# EAGLE design WallGrinder (EAGLE 9.1.3)
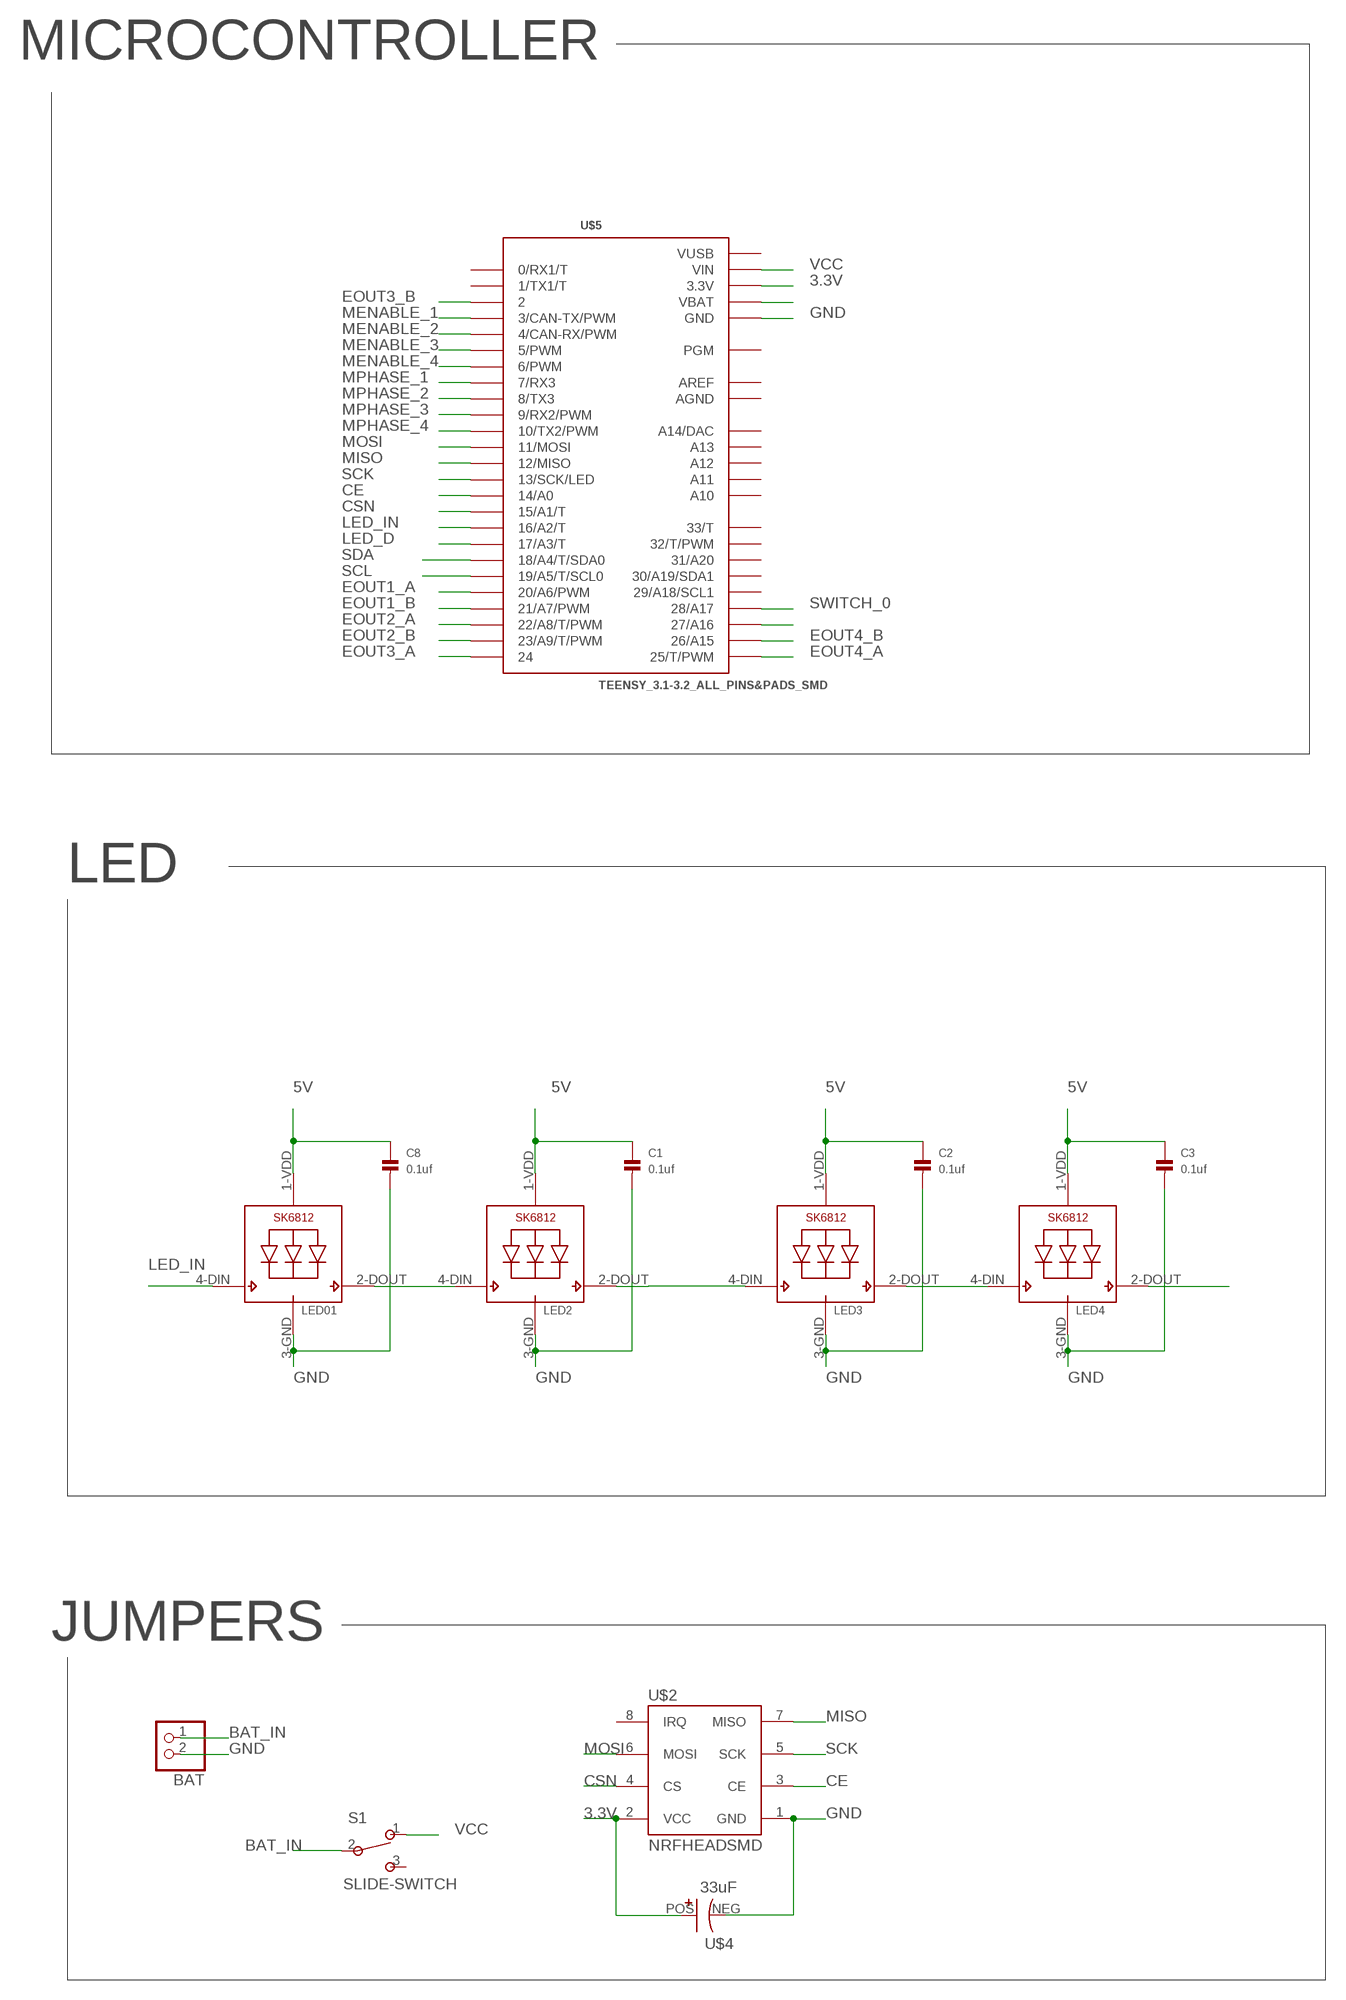
[diagram p0: schematic, sheet 1, part 1 of 2]
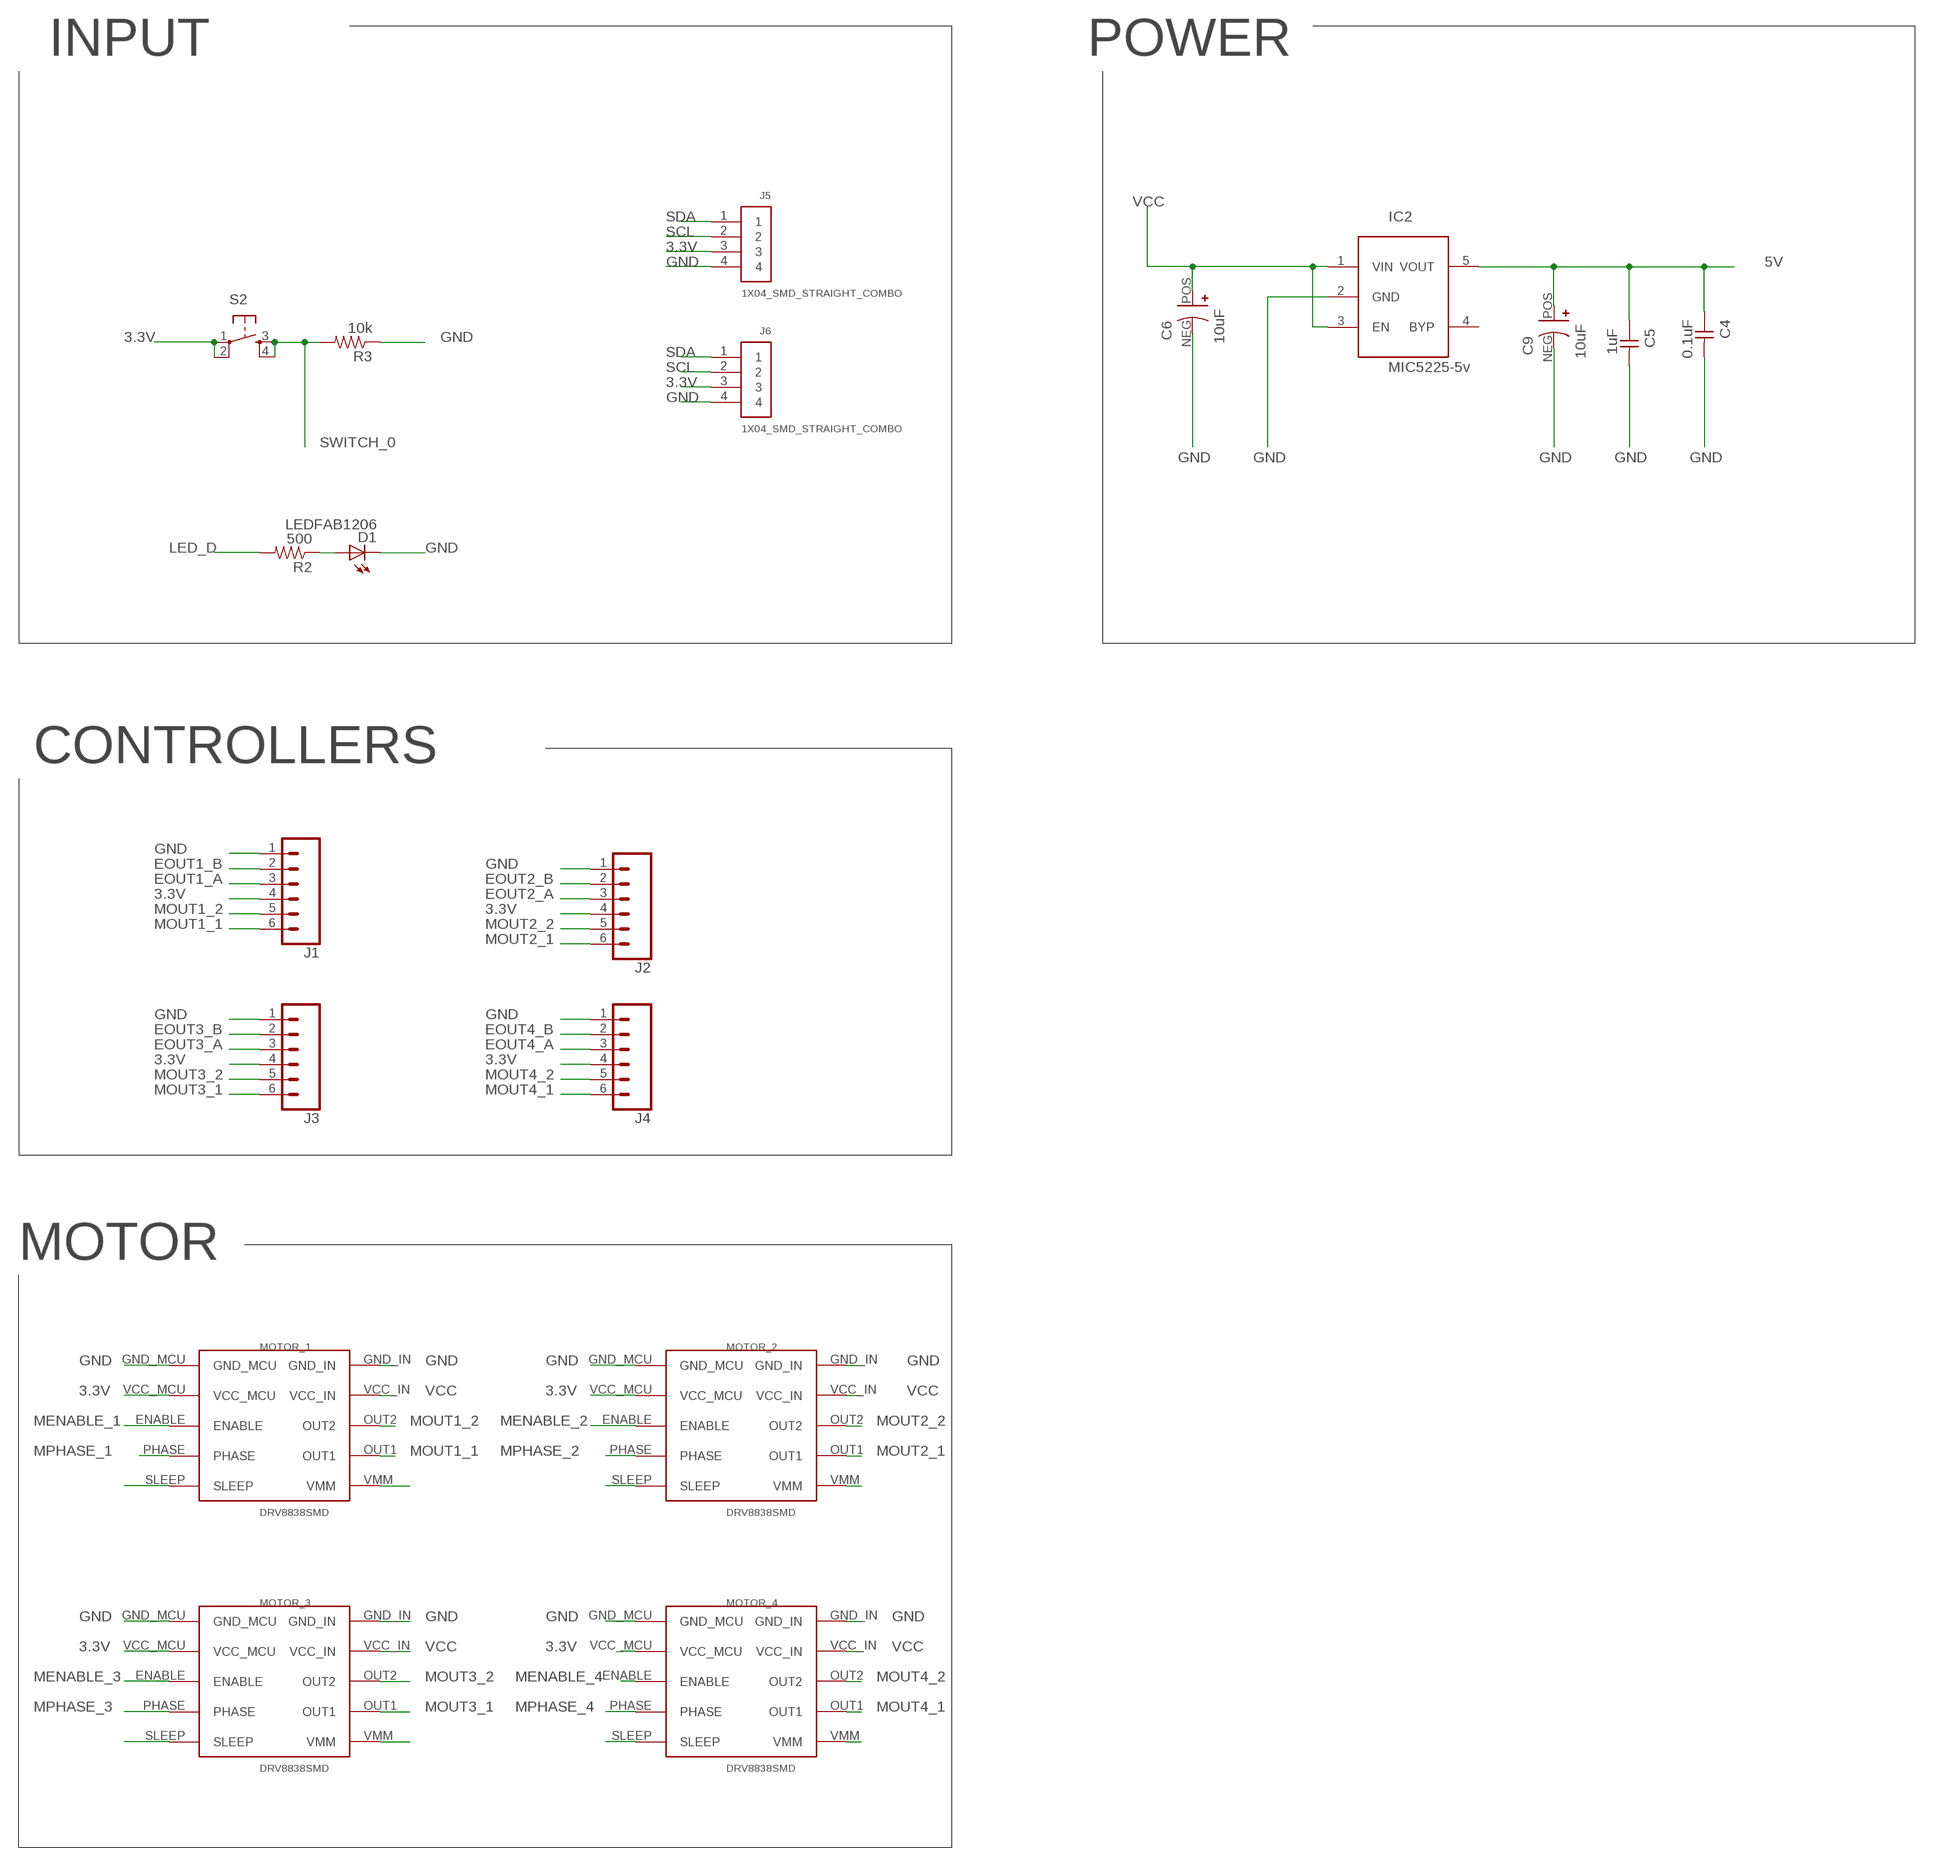
[diagram p1: schematic, sheet 1, part 2 of 2]

## Parts
BAT  JST_2PIN-SMT-RA  [JST-PH-2-SMT-RA]
C1  0.1uf  CAP_CERAMIC1206  [1206]
C2  0.1uf  CAP_CERAMIC1206  [1206]
C3  0.1uf  CAP_CERAMIC1206  [1206]
C4  0.1uF  CAP-UNPOLARIZEDFAB  [C1206FAB]
C5  1uF  CAP-UNPOLARIZEDFAB  [C1206FAB]
C6  10uF  POLCAP-PANASONIC-SMD-B01  [PANASONIC-CAP-SMD-B]
C8  0.1uf  CAP_CERAMIC1206  [1206]
C9  10uF  POLCAP-PANASONIC-SMD-B01  [PANASONIC-CAP-SMD-B]
D1  LEDFAB1206  [LED1206FAB]
IC2  MIC5225-5v  LP298XS  [SOT23-5L]
J1  CONN_06SMD_MALE  [1X06_SMD_MALE]
J2  CONN_06SMD_MALE  [1X06_SMD_MALE]
J3  CONN_06SMD_MALE  [1X06_SMD_MALE]
J4  CONN_06SMD_MALE  [1X06_SMD_MALE]
J5  1X04_SMD_STRAIGHT_COMBO  1X4SMT  [1X4-SMT]
J6  1X04_SMD_STRAIGHT_COMBO  1X4SMT  [1X4-SMT]
LED01  SK6812_5050  [LED5050]
LED2  SK6812_5050  [LED5050]
LED3  SK6812_5050  [LED5050]
LED4  SK6812_5050  [LED5050]
MOTOR_1  DRV8838SMD  [DRV8838SMD]
MOTOR_2  DRV8838SMD  [DRV8838SMD]
MOTOR_3  DRV8838SMD  [DRV8838SMD]
MOTOR_4  DRV8838SMD  [DRV8838SMD]
R2  500  RES-US1206FAB  [R1206FAB]
R3  10k  RES-US1206FAB  [R1206FAB]
S1  SLIDE-SWITCH  [AYZ0102AGRLC]
S2  6MM_SWITCH6MM_SWITCH  [6MM_SWITCH]
U$2  NRFHEADSMD  [2.54MM]
U$4  33uF  POLCAP-PANASONIC-SMD-C  [PANASONIC-CAP-SMD-C]
U$5  TEENSY_3.1-3.2_ALL_PINS&PADS_SMD  [TEENSY_3.0-3.2_ALL_PINS_&_PADS_SMD]

## Nets
3.3V: J1.4 J2.4 J3.4 J4.4 J5.3 J6.3 MOTOR_1.VCC_MCU MOTOR_2.VCC_MCU MOTOR_3.VCC_MCU MOTOR_4.VCC_MCU S2.1(P) S2.2(P1) U$2.2(VCC) U$4.POS(+) U$5.3.3V U$5.3.3V1(3.3V) U$5.3.3V2(3.3V)
5V: C1.1 C2.1 C3.1 C4.1 C5.1 C8.1 C9.POS(+) IC2.5(VOUT) LED01.1-VDD(VDD) LED2.1-VDD(VDD) LED3.1-VDD(VDD) LED4.1-VDD(VDD)
BAT_IN: BAT.1 S1.2
CE: U$2.3(CE) U$5.14/A0
CSN: U$2.4(CS) U$5.15/A1(15/A1/T)
EOUT1_A: J1.3 U$5.20/A6(20/A6/PWM)
EOUT1_B: J1.2 U$5.21/A7(21/A7/PWM)
EOUT2_A: J2.3 U$5.22/A8(22/A8/T/PWM)
EOUT2_B: J2.2 U$5.23/A9(23/A9/T/PWM)
EOUT3_A: J3.3 U$5.24
EOUT3_B: J3.2 U$5.2
EOUT4_A: J4.3 U$5.25(25/T/PWM)
EOUT4_B: J4.2 U$5.26(26/A15)
GND: BAT.2 C1.2 C2.2 C3.2 C4.2 C5.2 C6.NEG(-) C8.2 C9.NEG(-) D1.2(C) IC2.2(GND) J1.1 J2.1 J3.1 J4.1 J5.4 J6.4 LED01.3-GND(GND) LED2.3-GND(GND) LED3.3-GND(GND) LED4.3-GND(GND) MOTOR_1.GND_IN MOTOR_1.GND_MCU MOTOR_2.GND_IN MOTOR_2.GND_MCU MOTOR_3.GND_IN MOTOR_3.GND_MCU MOTOR_4.GND_IN MOTOR_4.GND_MCU R3.1 U$2.1(GND) U$4.NEG(-) U$5.GND U$5.GND1(GND) U$5.GND2(GND)
LED_D: R2.2 U$5.17/A3(17/A3/T)
LED_IN: LED01.4-DIN(DI) U$5.16/A2(16/A2/T)
LED_IN1: LED2.2-DOUT(DO) LED3.4-DIN(DI)
LED_IN2: LED3.2-DOUT(DO) LED4.4-DIN(DI)
MENABLE_1: MOTOR_1.ENABLE U$5.3(3/CAN-TX/PWM)
MENABLE_2: MOTOR_2.ENABLE U$5.4(4/CAN-RX/PWM)
MENABLE_3: MOTOR_3.ENABLE U$5.5(5/PWM)
MENABLE_4: MOTOR_4.ENABLE U$5.6(6/PWM)
MISO: U$2.7(MISO) U$5.12(12/MISO)
MOSI: U$2.6(MOSI) U$5.11(11/MOSI)
MOUT1_1: J1.6 MOTOR_1.OUT1
MOUT1_2: J1.5 MOTOR_1.OUT2
MOUT2_1: J2.6 MOTOR_2.OUT1
MOUT2_2: J2.5 MOTOR_2.OUT2
MOUT3_1: J3.6 MOTOR_3.OUT1
MOUT3_2: J3.5 MOTOR_3.OUT2
MOUT4_1: J4.6 MOTOR_4.OUT1
MOUT4_2: J4.5 MOTOR_4.OUT2
MPHASE_1: MOTOR_1.PHASE U$5.7(7/RX3)
MPHASE_2: MOTOR_2.PHASE U$5.8(8/TX3)
MPHASE_3: MOTOR_3.PHASE U$5.9(9/RX2/PWM)
MPHASE_4: MOTOR_4.PHASE U$5.10(10/TX2/PWM)
N$1: D1.1(A) R2.1
N$2: MOTOR_1.VMM
N$3: LED01.2-DOUT(DO) LED2.4-DIN(DI)
N$5: U$5.VBAT
N$7: U$5.27(27/A16)
N$8: LED4.2-DOUT(DO)
N$15: MOTOR_1.SLEEP
N$20: MOTOR_3.SLEEP
N$25: MOTOR_3.VMM
N$30: MOTOR_4.VMM
N$35: MOTOR_4.SLEEP
N$36: MOTOR_2.VMM
N$45: MOTOR_2.SLEEP
SCK: U$2.5(SCK) U$5.13(13/SCK/LED)
SCL: J5.2 J6.2 U$5.19/A5(19/A5/T/SCL0)
SDA: J5.1 J6.1 U$5.18/A4(18/A4/T/SDA0)
SWITCH_0: R3.2 S2.3(S) S2.4(S1) U$5.28(28/A17)
VCC: C6.POS(+) IC2.1(VIN) IC2.3(EN) MOTOR_1.VCC_IN MOTOR_2.VCC_IN MOTOR_3.VCC_IN MOTOR_4.VCC_IN S1.1 U$5.VIN
Unconnected: IC2.4(BYP) S1.3 U$2.8(IRQ) U$5.0(0/RX1/T) U$5.1(1/TX1/T) U$5.29(29/A18/SCL1) U$5.30(30/A19/SDA1) U$5.31(31/A20) U$5.32(32/T/PWM) U$5.33(33/T) U$5.A10 U$5.A11 U$5.A12 U$5.A13 U$5.PGM U$5.RESET/DAC(A14/DAC)

## Notes on the sheet
- MICROCONTROLLER | INPUT | POWER
- CONTROLLERS
- LED
- MOTOR
- JUMPERS

## Power pins joined to a net without a drawn wire
AGND: U$5.AGND
AREF: U$5.AREF
VUSB: U$5.VUSB

## Library data of the parts
BAT = adafruit:JST_2PIN: JST 2-Pin Connectors of various flavors SMT-RA (S2B-PH-SM4) 4UConnector #17311 SMT (B2B-PH-SM4) THM-RA (S2B-PH) THM (B2B-PH)
C1-C3 C8 = microbuilder:CAP_CERAMIC: Ceramic Capacitors 0402 - 0402 Surface Mount Capacitors 16pF 50V 5% [Digikey: 445-4899-2-ND] 18pF 50V 5% [Digikey: 490-1281-2-ND] 22pF 50V 5% [Digikey: 490-1283-2-ND] 68pF 50V 5% [Digikey: 490-1289-2-ND] 0.1uF 10V 10% [Digikey: 490-1318-2-ND] 1.0uF 6.3V 10% [Digikey: 490-1320-2-ND] 0603 - 0603 Surface Mount Capacitors 16 pF 50V 5% [Digikey: 445-5051-2-ND] 22 pF 50V [Digikey: PCC220ACVTR-ND] 33 pF 50V 5% [Digikey: 490-1415-1-ND] 56pF 50V 5% [Digikey: 490-1421-1-ND] 220pF 50V 5% [Digikey: 445-1285-1-ND] 680 pF 50V 2200 pF 50V 5% C0G [Digikey: 445-1297-1-ND] 5600 pF 100V 5% X7R [Digikey: 478-3711-1-ND] 0.1 µF 25V 10% [Digikey: PCC2277TR-ND] 0.22 µF 16V 10% X7R [Digikey: 445-1318-1-ND] 1.0 µF 25V 10% [Digikey: 445-5146-2-ND] 0603 - RF Specific 3pF 250V +/-0.1pF RF [Digikey: 712-1347-1-ND] 18 pF 250V 5% [Digikey: 478-3505-1-ND or 712-1322-1-ND] 56 pF 250V 5% C0G RF [Digikey: 490-4867-1-ND] 68 pF 250V RF [Digikey: 490-4868-1-ND] 0805 - 0805 Surface Mount Capacitors 220 pF 250V 2% RF Ceramic Capacitor [Digikey: 712-1398-1-ND] 1000 pF 50V 2% NP0 Ceramic Capacitor [Digikey: 478-3760-1-ND] 0.1 µF 25V 10% Ceramic Capacitor [Digikey: PCC1828TR-ND] 1.0 µF 16V 10% Ceramic Capacitor[Digikey: 490-1691-2-ND] 10.0 µF 10V 10% Ceramic Capacitor[Digikey: 709-1228-1-ND] 10.0 uF 16V 10% Ceramic Capacitor [Digikey: 478-5165-2-ND] 47 uF 6.3V 20% Ceramic Capacitor [Digikey: 587-1779-1-ND or 399-5506-1-ND] 1206 - 1206 Surface Mount Capacitors 47uF 10V 20% Ceramic Capacitor [Digikey: 490-5528-1-ND or 399-5508-1-ND or 445-6010-1-ND] 100uF 6.3V -20%, +80% Y5V Ceramic Capacitor (Digikey: 490-4512-1-ND, Mouser: 81-GRM31CF50J107ZE1L)
C4 C5 = fab:CAP-UNPOLARIZED
C6 C9 = talkingdrums:POLCAP-PANASONIC-SMD-B
D1 = fab:LED: LED
IC2 = adafruit:LP298X
J1 = SparkFun-Connectors:CONN_06: Multi connection point. Often used as Generic Header-pin footprint for 0.1 inch spaced/style header connections On any of the 0.1 inch spaced packages, you can populate with these: Break Away Headers - Straight <https://www.sparkfun.com/products/116> (PRT-00116) Break Away Male Headers - Right Angle <https://www.sparkfun.com/products/553> (PRT-00553) Female Headers <https://www.sparkfun.com/products/115> (PRT-00115) Break Away Headers - Machine Pin <https://www.sparkfun.com/products/117> (PRT-00117) Break Away Female Headers - Swiss Machine Pin <https://www.sparkfun.com/products/743> (PRT-00743) Arduino Stackable Header - 6 Pin <https://www.sparkfun.com/products/9280> (PRT-09280) For SCREWTERMINALS and SPRING TERMINALS visit here: Screw Terimnals on SparkFun.com <https://www.sparkfun.com/search/results?term=Screw+Terminals> (5mm/3.5mm/2.54mm spacing) This device is also useful as a general connection point to wire up your design to another part of your project. Our various solder wires solder well into these plated through hole pads. Hook-Up Wire - Assortment (Stranded, 22 AWG) <https://www.sparkfun.com/products/11375> (PRT-11375) Hook-Up Wire - Assortment (Solid Core, 22 AWG) <https://www.sparkfun.com/products/11367> (PRT-11367) View the entire wire category on our website here <https://www.sparkfun.com/categories/141>; PROD_ID: CONN-11293; SPICEPREFIX: X
J2-J4 = SparkFun-Connectors:CONN_06: Multi connection point. Often used as Generic Header-pin footprint for 0.1 inch spaced/style header connections On any of the 0.1 inch spaced packages, you can populate with these: Break Away Headers - Straight <https://www.sparkfun.com/products/116> (PRT-00116) Break Away Male Headers - Right Angle <https://www.sparkfun.com/products/553> (PRT-00553) Female Headers <https://www.sparkfun.com/products/115> (PRT-00115) Break Away Headers - Machine Pin <https://www.sparkfun.com/products/117> (PRT-00117) Break Away Female Headers - Swiss Machine Pin <https://www.sparkfun.com/products/743> (PRT-00743) Arduino Stackable Header - 6 Pin <https://www.sparkfun.com/products/9280> (PRT-09280) For SCREWTERMINALS and SPRING TERMINALS visit here: Screw Terimnals on SparkFun.com <https://www.sparkfun.com/search/results?term=Screw+Terminals> (5mm/3.5mm/2.54mm spacing) This device is also useful as a general connection point to wire up your design to another part of your project. Our various solder wires solder well into these plated through hole pads. Hook-Up Wire - Assortment (Stranded, 22 AWG) <https://www.sparkfun.com/products/11375> (PRT-11375) Hook-Up Wire - Assortment (Solid Core, 22 AWG) <https://www.sparkfun.com/products/11367> (PRT-11367) View the entire wire category on our website here <https://www.sparkfun.com/categories/141>; PROD_ID: CONN-11293
J5 J6 = adafruit:1X4: 4-pin connector
LED01 LED2-LED4 = SK6812:SK6812
MOTOR_1-MOTOR_4 = DRV8838:DRV8838
R2 R3 = fab:RES-US: Resistor (US Symbol) Variants with postfix FAB are widened to allow the routing of internal traces
S1 = fab:SLIDE-SWITCH: SMD slide-switch AYZ0102AGRLC as found in the fablab inventory. Includes the mounting holes. Made by Zaerc.
S2 = fab:6MM_SWITCH: OMRON SWITCH
U$2 = nrf:NRFHEAD
U$4 = talkingdrums:POLCAP-PANASONIC-SMD-C
U$5 = Teensy_3_and_LC_Series_Boards_v1.4:TEENSY_3.1-3.2_ALL_PINS&PADS_SMD: Footprint for Teensy 3.1 or 3.2 board using all pads and all through-holes. Pads need a 2x7 0.1" SMD header.

## Net classes
0 default: width 0.22 mm, clearance 0.225 mm

## Board
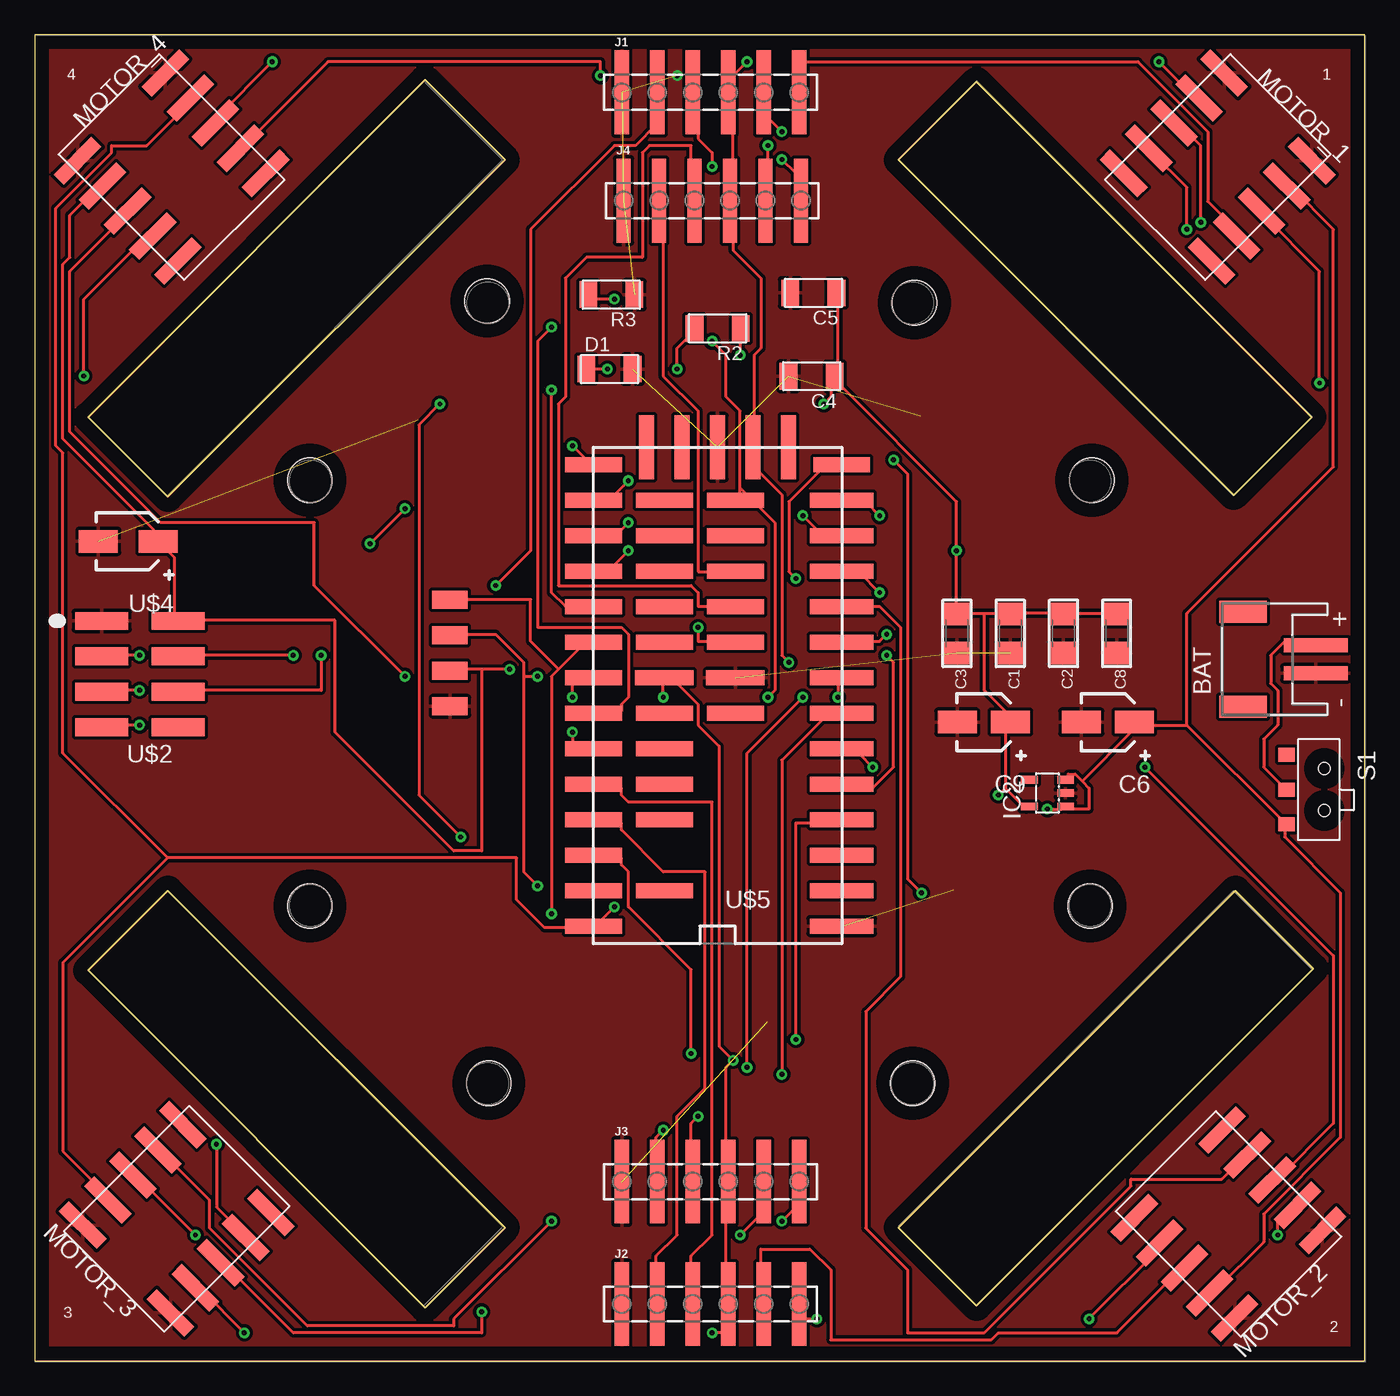
[diagram p2: board, top side]
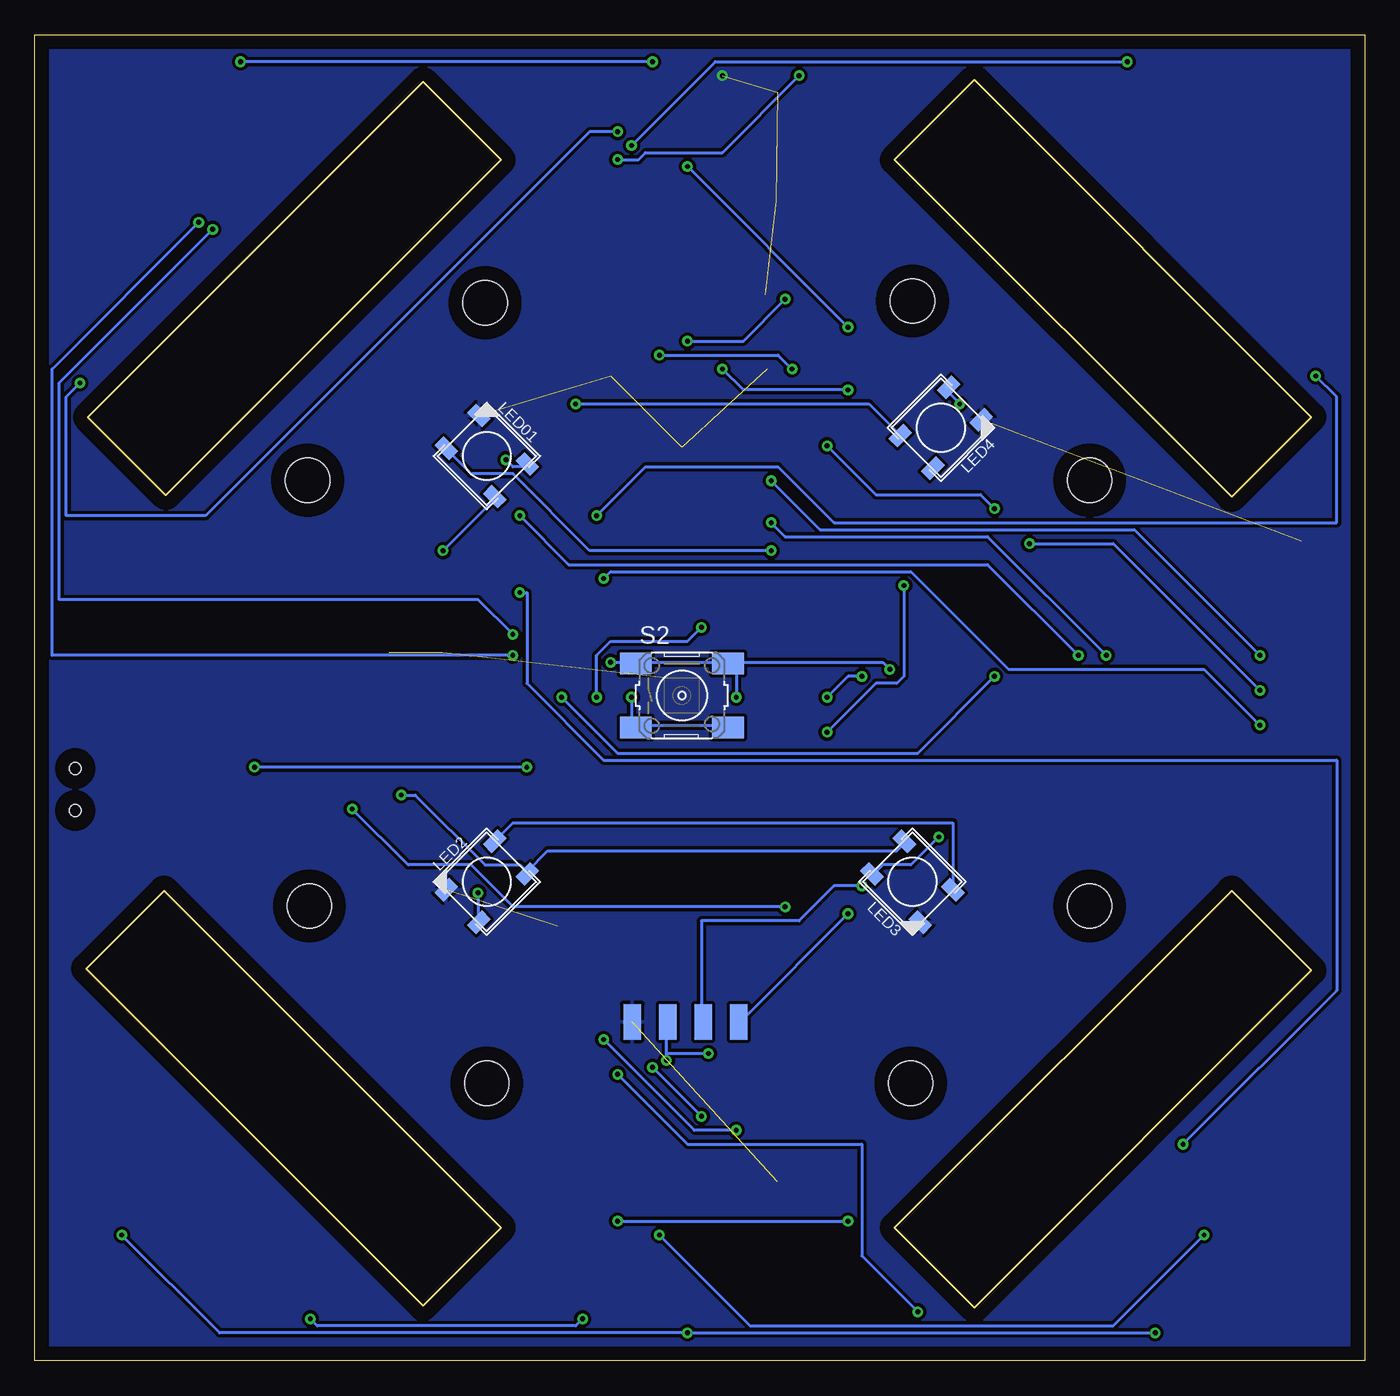
[diagram p3: board, bottom side, seen from below]

Size 95.23 x 94.92 mm. Coordinates in mm from the lower left corner, seen from the top.
Outline: 0,0 95.23,0 95.23,94.92 0,94.92 0,0
Outline: 3.81,27.94 9.53,33.66 33.66,9.53 27.94,3.81 3.81,27.94
Outline: 61.85,9.53 67.44,3.94 91.57,28.07 85.98,33.66 61.85,9.53
Outline: 85.85,61.98 91.44,67.56 67.44,91.57 61.85,85.98 85.85,61.98
Outline: 9.53,61.85 3.81,67.56 27.94,91.69 33.66,85.98 9.53,61.85
Copper layers (1*16): Top 0.035mm / dielectric 1.5mm / Bottom 0.035mm
Design rules "default": minimum track width 6mil, minimum drill 0.35mm, track to track 6mil, track to pad 6mil, pad to pad 6mil, via to via 6mil, smd to smd 6mil, copper to edge 40mil, drill to drill 6mil, minimum pad ring 10mil, minimum via ring 8mil, stop-mask expansion 4mil, vias tented up to drill 0mil, thermal gap 10mil
Holes 3.17 mm at 19.68,32.56 32.51,19.86 62.87,19.86 75.56,32.56 75.69,63.04 62.99,75.74 32.38,75.87 19.68,63.04

### Footprints (pad centres in the part's own frame; a part is rotated, then mirrored left to right if it is on the bottom)
JST-PH-2-SMT-RA = smd 1 x 4.6: 1 1,-3.7; 2 -1,-3.7 | smd 1.6 x 3.4: NC1 -3.4,1.5; NC2 3.4,1.5
1206 = smd 1.6 x 1.8: 1 -1.4,0; 2 1.4,0
C1206FAB = smd 1.27 x 1.905: 1 -1.651,0; 2 1.651,0
PANASONIC-CAP-SMD-B = smd 1.6 x 2.794: NEG 0,3.794; POS 0,0
LED1206FAB = smd 1.27 x 1.905: 1 -1.651,0; 2 1.651,0
SOT23-5L = smd 0.55 x 1.2: 1 -0.95,-1.3; 2 0,-1.3; 3 0.95,-1.3; 4 0.95,1.3; 5 -0.95,1.3
1X06_SMD_MALE = smd 1.02 x 6: 1 0,0; 2 2.54,0; 3 5.08,0; 4 7.62,0; 5 10.16,0; 6 12.7,0
1X4-SMT = smd 1.27 x 2.54: 1 -3.81,0; 2 -1.27,0; 3 1.27,0; 4 3.81,0
LED5050 = smd 1.5 x 0.9: 1-VDD 2.45,-1.65; 2-DOUT 2.45,1.65; 3-GND -2.45,1.65; 4-DIN -2.45,-1.65
DRV8838SMD = smd 3.81 x 1.016: ENABLE -4.445,0; GND_IN 4.445,5.08; GND_MCU -4.445,5.08; OUT1 4.445,-2.54; OUT2 4.445,0; PHASE -4.445,-2.54; SLEEP -4.445,-5.08; VCC_IN 4.445,2.54; VCC_MCU -4.445,2.54; VMM 4.445,-5.08
R1206FAB = smd 1.27 x 1.905: 1 -1.651,0; 2 1.651,0
AYZ0102AGRLC = smd 1 x 1.2: 1 2.5,-2.3; 2 0,-2.3; 3 -2.5,-2.3 | hole 0.85: -1.5,0.4; 1.5,0.4
6MM_SWITCH = smd 2.286 x 1.524: 1 -3.302,2.286; 2 3.302,2.286; 3 -3.302,-2.286; 4 3.302,-2.286
2.54MM = smd 3.81 x 1.27: 1 0,0; 2 -5.486,0; 3 0,2.54; 4 -5.486,2.54; 5 0,5.08; 6 -5.486,5.08; 7 0,7.62; 8 -5.486,7.62
PANASONIC-CAP-SMD-C = smd 1.6 x 2.794: NEG 0,4.294; POS 0,0
TEENSY_3.0-3.2_ALL_PINS_&_PADS_SMD = smd 4.572 x 1.067: 0 -8.89,13.97; 1 -8.89,11.43; 2 -8.89,8.89; 3 -8.89,6.35; 4 -8.89,3.81; 5 -8.89,1.27; 6 -8.89,-1.27; 7 -8.89,-3.81; 8 -8.89,-6.35; 9 -8.89,-8.89; 10 -8.89,-11.43; 11 -8.89,-13.97; GND -8.89,16.51 | smd 4.064 x 1.067: 3.3V 8.89,11.43; 12 -8.89,-16.51; 13 8.89,-16.51; 14/A0 8.89,-13.97; 15/A1 8.89,-11.43; 16/A2 8.89,-8.89; 17/A3 8.89,-6.35; 18/A4 8.89,-3.81; 19/A5 8.89,-1.27; 20/A6 8.89,1.27; 21/A7 8.89,3.81; 22/A8 8.89,6.35; 23/A9 8.89,8.89; 24 -1.27,-3.81; 25 -1.27,-6.35; 26 -1.27,-8.89; 27 -1.27,-11.43; 28 -1.27,-13.97; 29 3.81,-13.97; 30 3.81,-11.43; 31 3.81,-8.89; 32 3.81,-6.35; 33 3.81,-3.81; A10 3.81,6.35; A11 3.81,3.81; A12 -1.27,1.27; A13 3.81,1.27; AGND 8.89,13.97; AREF 3.81,8.89; VIN 8.89,16.51; VUSB 3.81,13.97 | smd 1.067 x 4.572: 3.3V1 -2.54,-17.78; GND1 0,-17.78; PGM 2.54,-17.78; RESET/DAC 5.08,-17.78; VBAT -5.08,-17.78 | smd 4.191 x 1.067: 3.3V2 3.81,-1.27; GND2 -1.27,-1.27

### Placement (x,y rotation side)
BAT  88.04,50.22 90 top
C1  69.85,52.07 270 top
C2  73.66,52.07 270 top
C3  66.04,52.07 270 top
C4  55.63,70.48 180 top
C5  55.75,76.45 180 top
C6  78.74,45.72 90 top
C8  77.47,52.07 270 top
C9  69.85,45.72 90 top
D1  41.15,70.99 0 top
IC2  72.52,40.64 90 top
J1  42.04,90.81 0 top
J2  42.04,4.06 0 top
J3  42.04,12.83 0 top
J4  42.16,83.06 0 top
J5  48.64,24.26 180 bottom
J6  29.72,50.67 270 top
LED01  62.87,64.77 315 bottom
LED2  62.87,34.29 45 bottom
LED3  32.38,34.29 135 bottom
LED4  30.35,66.8 225 bottom
MOTOR_1  84.72,85.46 315 top
MOTOR_2  85.48,9.79 225 top
MOTOR_3  10.16,10.16 135 top
MOTOR_4  9.79,85.46 45 top
R2  48.9,73.91 180 top
R3  41.27,76.33 180 top
S1  91.95,40.89 270 top
S2  48.9,47.62 0 bottom
U$2  4.78,52.97 180 top
U$4  8.84,58.66 90 top
U$5  48.9,47.62 180 top

### Tracks (layer width: path | path; a pad name or v marks a point on that pad's centre or on a via)
3.3V  (via drill 0.35)
  Top 0.22: v47,22 47,28 42.5,32.5 42.5,35 42,35.5 42,36 40.5,36 U$5.3.3V | v15,2 12,5 MOTOR_3.VCC_MCU | v48.5,2 49.5,2 49.5,4 J2.4 49.5,4.5 49.5,12.5 J3.4 49.5,13 49.5,21 v50,21.5 49,22.5 49,44 47.5,45.5 47.5,47 45.5,49 U$5.3.3V2 45,48.5 v45,47.5 | v89,9 89,10 90,11 MOTOR_2.VCC_MCU | v80.5,93 83,90.5 MOTOR_1.VCC_MCU | v51,93 50,92 50,91 J1.4 50,90.5 50,83.5 J4.4 50,83 50,79.5 52,77.5 52,72.5 51.5,72 51.5,65.5 U$5.3.3V1 51.5,65 51.5,64 53.5,62 53.5,50.5 v54,50 | MOTOR_4.VCC_MCU 4.5,84 2.5,82 2.5,79 2,78.5 2,66 8.5,59.5 8.5,59 U$4.POS 9,58.5 10,57.5 10,53 U$2.2 10.5,53 21.5,53 21.5,45 30,36.5 32,36.5 32,49.5 | v34,49.5 32,49.5 | 32,49.5 30,49.5 J6.3
  Bottom 0.22: v50,21.5 50,22 | 50,22 50,24 J5.3 | 50,22 v47,22 | v15,2 v48.5,2 82,2 v89,9 | v51,93 v80.5,93 | S2.2 46,50 52,50 S2.1 52.5,50 v54,50 | v34,49.5 34.5,50 45,50 | 45,50 45.5,50 S2.2 | 45,50 v45,47.5 | 45,50 S2.2
5V  (via drill 0.35)
  Top 0.22: v56.5,68.5 57,69 57,70 C4.1 | C5.1 57.5,76 57.5,70.5 C4.1 | C8.1 77,53.5 74,53.5 C2.1 73.5,53.5 70,53.5 C1.1 69.5,53.5 68,53.5 | 68,53.5 66.5,53.5 C3.1 66,53.5 v66,58 66,61.5 57.5,70 C4.1 | 69.5,41 71,39.5 IC2.5 | 69.5,41 69.5,45.5 C9.POS 69.5,46 69.5,46.5 68,48 68,53.5 | 69.5,41 v69,40.5
  Bottom 0.22: v56.5,68.5 35.5,68.5 33.5,66.5 LED4.1-VDD | v66,58 62.5,61.5 LED01.1-VDD | 60,35 60.5,35.5 63,35.5 68,40.5 v69,40.5 | 60,35 58.5,36.5 33.5,36.5 33,37 LED3.1-VDD | 60,35 LED2.1-VDD
BAT_IN
  Top 0.22: S1.2 89.5,41 88,42.5 88,44.5 89,45.5 89,48 88.5,48.5 88.5,50.5 89.5,51.5 91.5,51.5 BAT.1
CE  (via drill 0.35)
  Top 0.22: v7.5,50.5 5,50.5 U$2.3 | v42.5,63 41.5,62 40.5,62 U$5.14/A0
  Bottom 0.22: v7.5,50.5 16.5,59.5 39,59.5 v42.5,63
CSN  (via drill 0.35)
  Top 0.22: v18.5,50.5 10.5,50.5 U$2.4 | v42.5,60 41.5,59 40.5,59 U$5.15/A1
  Bottom 0.22: v18.5,50.5 27,59 41.5,59 v42.5,60
EOUT1_A  (via drill 0.35)
  Top 0.22: v37,74 36,73 36,52.5 42,52.5 42.5,52 42.5,47.5 42,47 42,46.5 40.5,46.5 U$5.20/A6 | v48.5,85.5 48.5,86.5 47.5,87.5 47.5,90.5 J1.3
  Bottom 0.22: v48.5,85.5 v37,74
EOUT1_B  (via drill 0.35)
  Top 0.22: v38.5,45 38.5,44 40,44 U$5.21/A7 | v33,55.5 35.5,58 35.5,81 41.5,87 43,87 44.5,88.5 44.5,90.5 J1.2
  Bottom 0.22: v38.5,45 35,48.5 33.5,48.5 33,49 v33,55.5
EOUT2_A
  Top 0.22: U$5.22/A8 40.5,41 42,41 42,40.5 42.5,40 48.5,40 48.5,9 47,7.5 47,4.5 J2.3
EOUT2_B
  Top 0.22: U$5.23/A9 40.5,38.5 42,38.5 42,38 45,35 48,35 48,19.5 46,17.5 46,9 44.5,7.5 44.5,4.5 J2.2
EOUT3_A  (via drill 0.35)
  Top 0.22: v47.5,52.5 47.5,51.5 50,51.5 U$5.24 | v55,47.5 51,43.5 v51,21 | v47.5,17.5 47,17 47,13 J3.3
  Bottom 0.22: v47.5,52.5 48.5,51.5 54,51.5 55,50.5 v55,47.5 | v47.5,17.5 v51,21
EOUT3_B  (via drill 0.35)
  Top 0.22: v54.5,23 54.5,38.5 57.5,38.5 U$5.2 | v45,16.5 44.5,16 44.5,13 J3.2
  Bottom 0.22: v54.5,23 48,16.5 v45,16.5
EOUT4_A
  Top 0.22: U$5.25 50,54 47.5,54 47.5,55 47,55.5 37.5,55.5 37.5,68.5 38,69 38,77.5 39.5,79 43.5,79 43.5,86.5 44,87 47,87 47,83.5 J4.3
EOUT4_B
  Top 0.22: U$5.26 50,56.5 47.5,56.5 47.5,68 45,70.5 45,83 J4.2
GND  (via drill 0.35)  (11 unrouted)
  other vias: 46,92
  pour Top: 0,95 95.5,95 95.5,0 0,0
  pour Bottom: 0,95 95.5,95 95.5,0 0,0
LED_D  (via drill 0.35)
  Top 0.22: v46,71 46,72.5 47,73.5 R2.2 | v37,69.5 37,55 38,54 40,54 U$5.17/A3
  Bottom 0.22: v46,71 44.5,69.5 v37,69.5
LED_IN  (via drill 0.35)
  Top 0.22: v42.5,58 41,56.5 40.5,56.5 U$5.16/A2
  Bottom 0.22: v42.5,58 55.5,58 61,63.5 64,63.5 65.5,65 LED01.4-DIN
LED_IN1
  Bottom 0.22: LED3.4-DIN 29.5,34 29.5,38.5 61,38.5 62,37.5 LED2.2-DOUT
LED_IN2  (via drill 0.35)
  Top 0.22: v30.5,37.5 27.5,40.5 27.5,67 v29,68.5
  Bottom 0.22: v30.5,37.5 32.5,35.5 34.5,35.5 35,35 LED3.2-DOUT | v29,68.5 30,69.5 LED4.4-DIN
MENABLE_1  (via drill 0.35)
  Top 0.22: v83.5,81.5 83.5,87 82,88.5 MOTOR_1.ENABLE | v61,50.5 61.5,50 61.5,42.5 60,41 58,41 U$5.3
  Bottom 0.22: v83.5,81.5 94,71 94,50.5 v61,50.5
MENABLE_2  (via drill 0.35)
  Top 0.22: v79.5,42.5 93,29 93,17 89,13 MOTOR_2.ENABLE | v60,42.5 59,43.5 58,43.5 U$5.4
  Bottom 0.22: v60,42.5 v79.5,42.5
MENABLE_3  (via drill 0.35)
  Top 0.22: v32,3.5 32,2 18.5,2 13.5,7 MOTOR_3.ENABLE | v53.5,20.5 53.5,43 56.5,46 57.5,46 U$5.5
  Bottom 0.22: v32,3.5 36,7.5 36,15.5 48.5,15.5 v53.5,20.5
MENABLE_4  (via drill 0.35)
  Top 0.22: v26.5,49 20,55.5 20,60 9,60 2.5,66.5 2.5,78 6.5,82 MOTOR_4.ENABLE | v57.5,47.5 57.5,48.5 U$5.6
  Bottom 0.22: v26.5,49 32,43.5 53.5,43.5 v57.5,47.5
MISO  (via drill 0.35)
  Top 0.22: v7.5,45.5 5,45.5 U$2.7 | v54.5,56 54,56.5 54,61.5 56.5,64 57.5,64 U$5.12
  Bottom 0.22: v7.5,45.5 11.5,49.5 25.5,49.5 32.5,56.5 54,56.5 v54.5,56
MOSI  (via drill 0.35)
  Top 0.22: v20.5,50.5 20.5,48 10.5,48 U$2.6 | v60.5,60.5 59.5,61.5 58,61.5 U$5.11
  Bottom 0.22: v20.5,50.5 27,57 57,57 v60.5,60.5
MOUT1_1
  Top 0.22: MOTOR_1.OUT1 86,81 84,83 84,88 79,93 55,93 55,91 J1.6
MOUT1_2  (via drill 0.35)
  Top 0.22: v92,70 92,78 88,82 MOTOR_1.OUT2 | v53.5,88 52.5,89 52.5,90.5 J1.5
  Bottom 0.22: v92,70 93,69 93,60.5 83,60.5 55.5,88 v53.5,88
MOUT2_1  (via drill 0.35)
  Top 0.22: v75.5,3 80.5,8 MOTOR_2.OUT1 | v56,3 55,3 55,4 J2.6
  Bottom 0.22: v75.5,3 75,2.5 56.5,2.5 v56,3
MOUT2_2
  Top 0.22: MOTOR_2.OUT2 82,6.5 77.5,2 69,2 68.5,1.5 57,1.5 57,6.5 55.5,8 52,8 52,4.5 J2.5
MOUT3_1  (via drill 0.35)
  Top 0.22: v37,10 30,3 30,2.5 19.5,2.5 12.5,9.5 12.5,11.5 9,15 MOTOR_3.OUT1 | v53.5,10 54.5,11 54.5,12.5 J3.6
  Bottom 0.22: v53.5,10 v37,10
MOUT3_2  (via drill 0.35)
  Top 0.22: v11.5,9 7.5,13 MOTOR_3.OUT2 | v50.5,9 52,10.5 52,12.5 J3.5
  Bottom 0.22: v11.5,9 18,2.5 44,2.5 v50.5,9
MOUT4_1  (via drill 0.35)
  Top 0.22: v40.5,92 40.5,93 21,93 15,87 MOTOR_4.OUT1 | v53.5,86 54.5,85 54.5,83.5 J4.6
  Bottom 0.22: v40.5,92 46,86.5 51.5,86.5 52,86 v53.5,86
MOUT4_2  (via drill 0.35)
  Top 0.22: v17,93 13,89 MOTOR_4.OUT2 | v52.5,87 52.5,83.5 J4.5
  Bottom 0.22: v17,93 46.5,93 v52.5,87
MPHASE_1  (via drill 0.35)
  Top 0.22: v82.5,81 82.5,84 80,86.5 MOTOR_1.PHASE | v61,52 60.5,51.5 58,51.5 U$5.7
  Bottom 0.22: v82.5,81 93.5,70 93.5,54.5 63.5,54.5 v61,52
MPHASE_2
  Top 0.22: MOTOR_2.PHASE 86.5,14.5 85,13 78.5,13 78.5,12.5 68,2 62.5,2 62.5,6.5 59.5,9.5 59.5,25 62,27.5 62,52.5 60.5,54 58,54 U$5.8
MPHASE_3  (via drill 0.35)
  Top 0.22: v13,15.5 13,11 15,9 MOTOR_3.PHASE | v60.5,55 59,56.5 58,56.5 U$5.9
  Bottom 0.22: v13,15.5 2,26.5 2,43 54.5,43 60,48.5 60,55 v60.5,55
MPHASE_4  (via drill 0.35)
  Top 0.22: v3.5,70.5 3.5,76 8,80.5 MOTOR_4.PHASE | v55,60.5 56.5,59 57.5,59 U$5.10
  Bottom 0.22: v3.5,70.5 2,69 2,60 38,60 42,64 51.5,64 v55,60.5
N$1  (via drill 0.35)
  Top 0.22: v41,71 D1.1 | v50.5,72 50.5,73.5 R2.1
  Bottom 0.22: v41,71 42,72 v50.5,72
N$3  (via drill 0.35)
  Top 0.22: v63.5,33.5 62.5,34.5 62.5,63.5 v61.5,64.5
  Bottom 0.22: v63.5,33.5 63.5,31.5 LED2.4-DIN | v61.5,64.5 61,64 60,64 LED01.2-DOUT
SCK  (via drill 0.35)
  Top 0.22: v7.5,48 5,48 U$2.5 | v26.5,61 v24,58.5 | v38.5,65.5 40,64 U$5.13
  Bottom 0.22: v7.5,48 18,58.5 v24,58.5 | v26.5,61 27.5,62 35,62 v38.5,65.5
SCL  (via drill 0.35)
  Top 0.22: v36,34 35,35 35,49 | 35,49 35,50 33,52 30,52 J6.2 | v38.5,47.5 38.5,48.5 40,48.5 U$5.19/A5 | 35,49 v36,49
  Bottom 0.22: v36,34 38,34 40.5,31.5 47.5,31.5 47.5,24.5 J5.2 | v38.5,47.5 37,49 v36,49
SDA  (via drill 0.35)
  Top 0.22: v37,32 37,49 37.5,49.5 | 37.5,49.5 39.5,51.5 40,51.5 U$5.18/A4 | 37.5,49.5 35.5,51.5 35.5,54.5 30,54.5 J6.1
  Bottom 0.22: v37,32 44.5,24.5 J5.1
SWITCH_0  (via drill 0.35)
  Top 0.22: v41.5,76 40,76 R3.2 | v48.5,73 49.5,72 49.5,69 50.5,68 50.5,62.5 | 50.5,62.5 50.5,62 U$5.28 | v52.5,47.5 53,48 53,60 50.5,62.5
  Bottom 0.22: S2.4 46,45.5 52,45.5 S2.3 52.5,45.5 v52.5,47.5 | v41.5,76 44.5,73 v48.5,73
VCC  (via drill 0.35)
  Top 0.22: 75,41.5 74.5,42 74,42 74,41.5 IC2.3 | 75,41.5 75.5,41 75.5,39.5 74,39.5 IC2.1 73.5,39.5 v72.5,39.5 | 82.5,45.5 89.5,38.5 S1.1 89.5,38 89.5,37.5 93.5,33.5 93.5,16 88,10.5 88,8.5 84.5,5 MOTOR_2.VCC_IN | 82.5,45.5 79,45.5 C6.POS 78.5,45.5 78.5,45 75,41.5 | 82.5,45.5 82.5,53.5 93,64 93,81 90,84 MOTOR_1.VCC_IN | 9.5,36 2,28.5 2,15 5,12 MOTOR_3.VCC_IN | 9.5,36 34.5,36 34.5,33 36.5,31 40,31 U$5.VIN 40.5,31.5 v41.5,32.5 | 9.5,36 2,43.5 2,65 1.5,65.5 1.5,82.5 5.5,86.5 5.5,87 8,87 11,90 MOTOR_4.VCC_IN
  Bottom 0.22: v72.5,39.5 68.5,35.5 64,35.5 61,32.5 v41.5,32.5

### Text on the board
tNames: 4 | 1 | 3 | 2